# EasyEDA Pro project Nets and Buses.epro

# Schematic Schematic1
Board Name: Board1; Create Date: 2026-07-05; Page Name: P1; Project Name: Nets; Schematic Name: Schematic1; Update Date: 2026-07-05; Company: EasyEDA.com; Page Size: A4; Version: V1.0
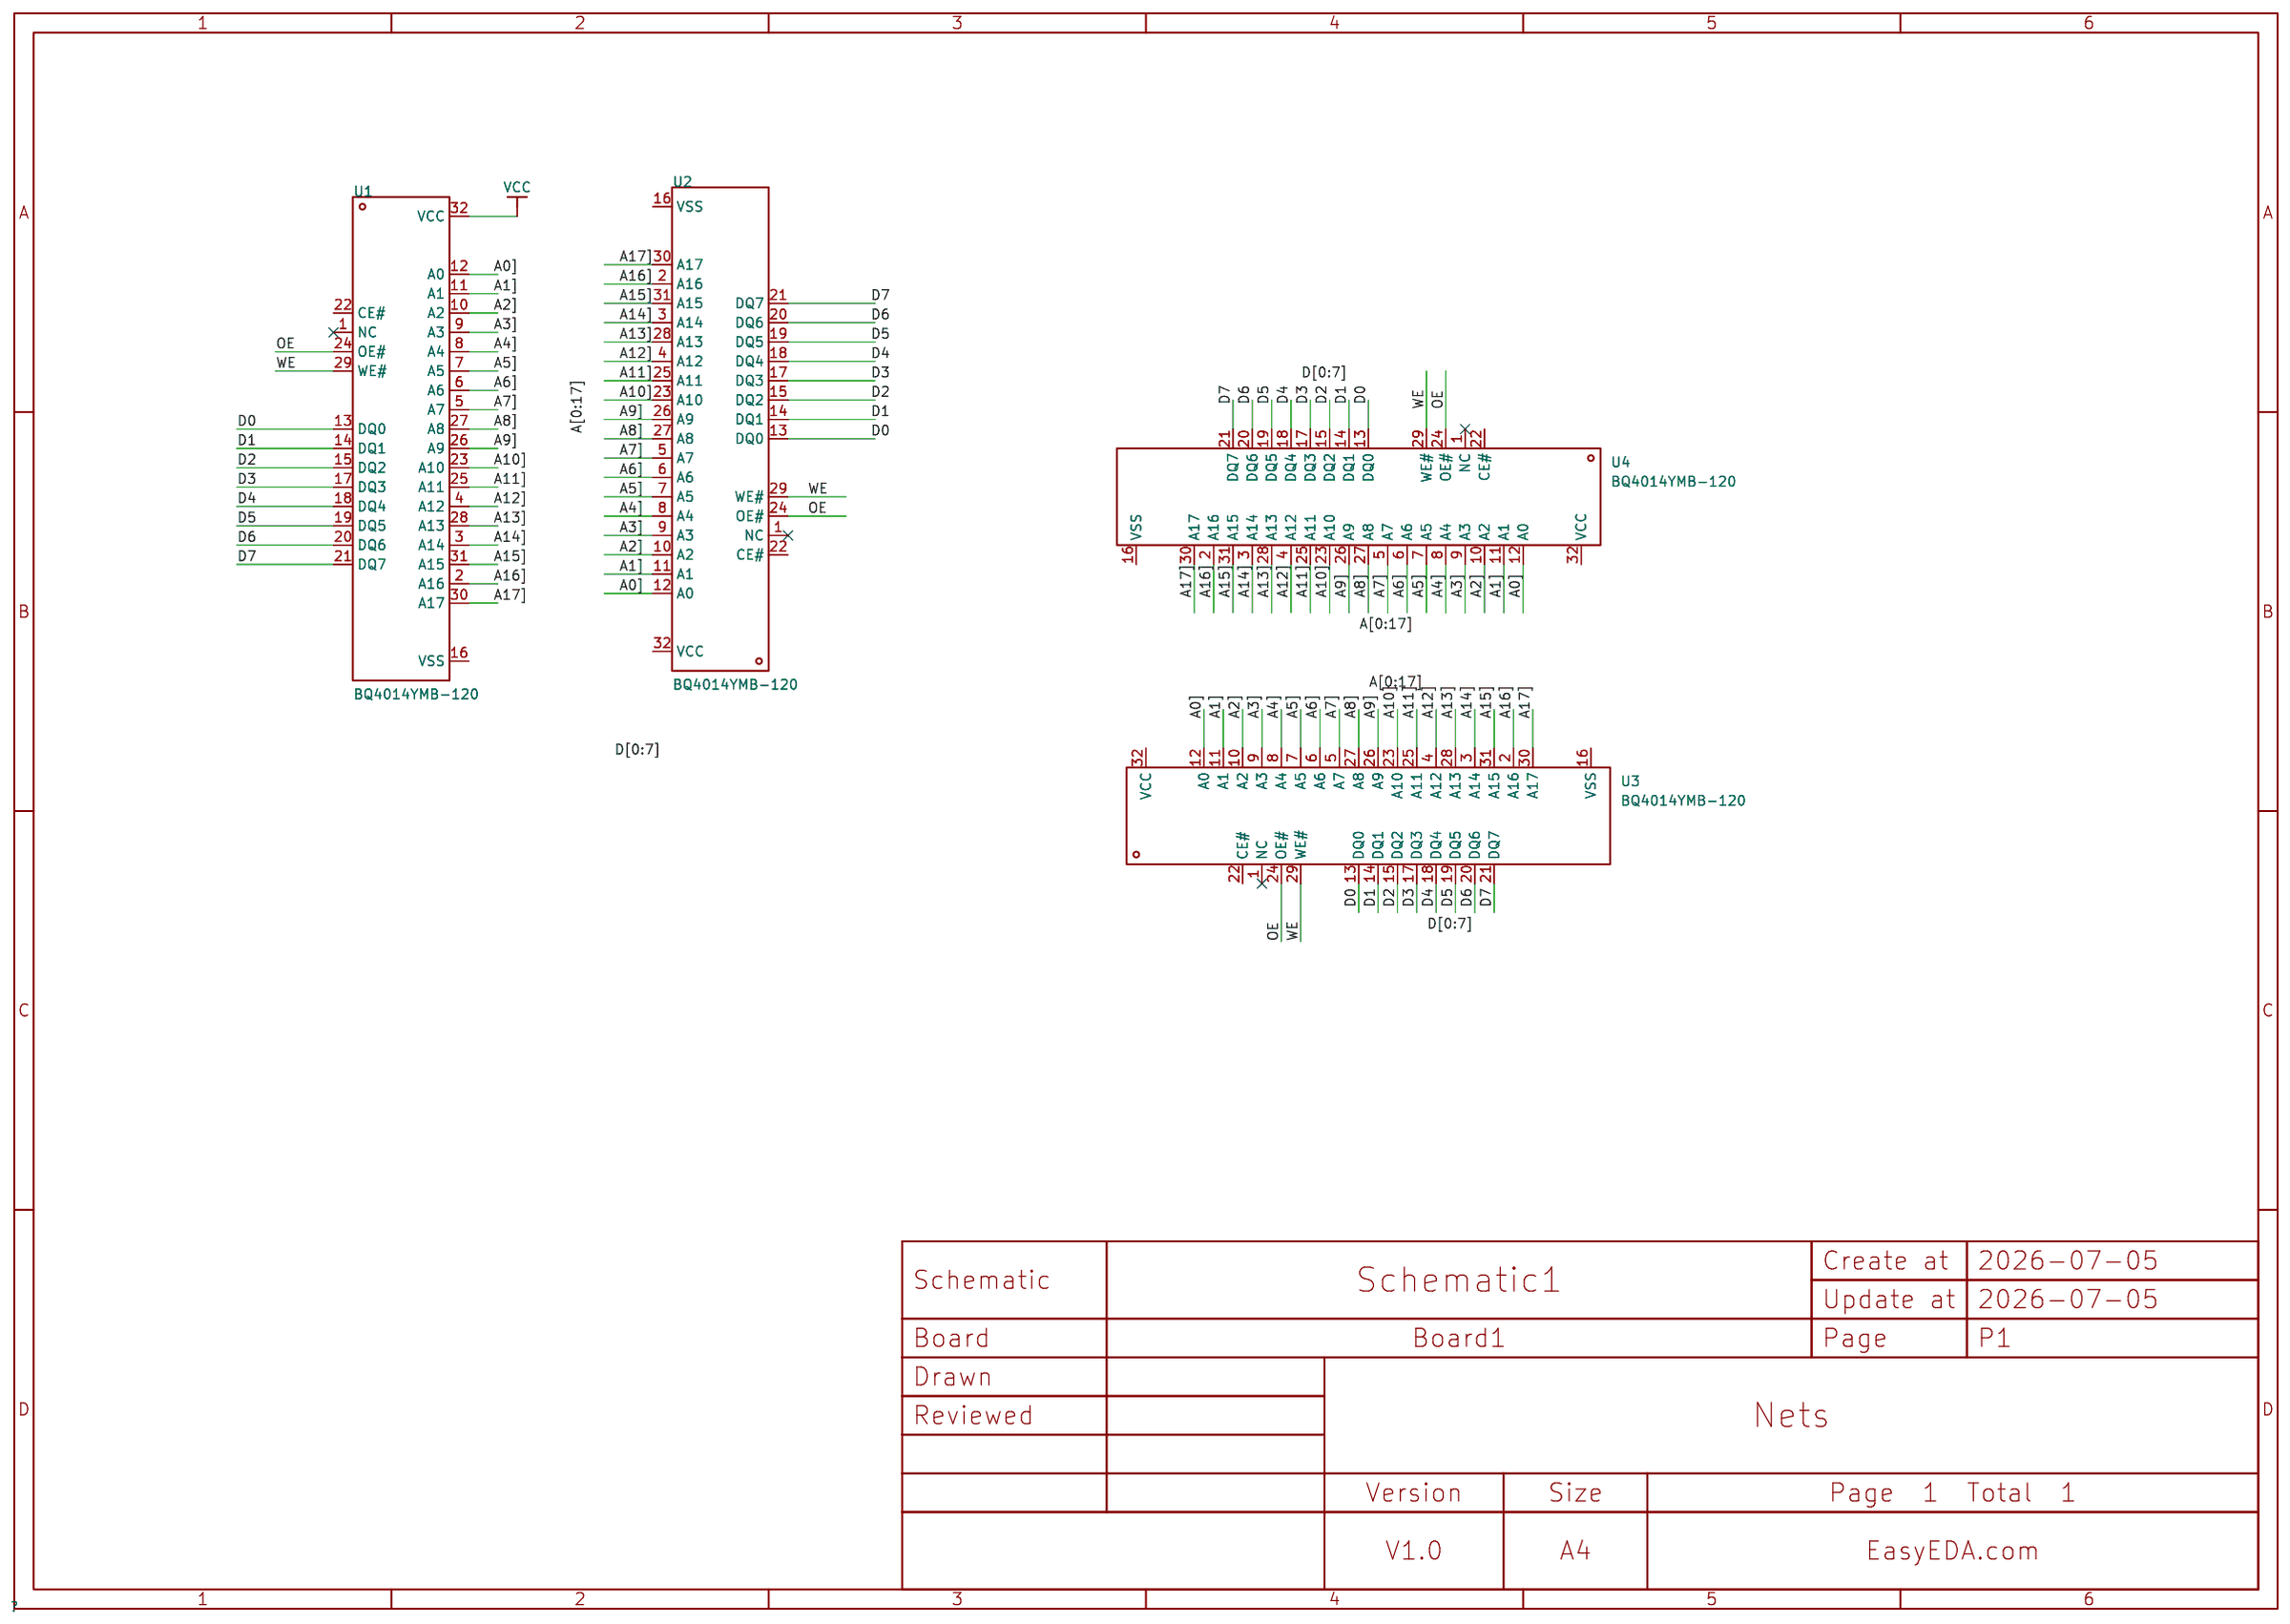
[diagram p0: schematic sheet]

## Parts
U1  BQ4014YMB-120  [EDIP-32_L53.0-W18.8-P2.54-LS16.0-BL]
U2  BQ4014YMB-120  [EDIP-32_L53.0-W18.8-P2.54-LS16.0-BL]
U3  BQ4014YMB-120  [EDIP-32_L53.0-W18.8-P2.54-LS16.0-BL]
U4  BQ4014YMB-120  [EDIP-32_L53.0-W18.8-P2.54-LS16.0-BL]

## Library data of the parts
U1-U4 = BQ4014YMB-120: Voltage - Supply:4.75V~5.5V Voltage - Supply:4.75V~5.5V Access Time:120ns; Supplier Part: C20525351; Manufacturer: TI(德州仪器); Supplier Footprint: 32-DIP Module (18.42x52.96); JLCPCB Part Class: Extended Part; Supplier: LCSC; Voltage - Supply: 4.75V~5.5V; Access Time: 120ns

## Nets
VCC: U1.32(VCC)
A0]: U1.12(A0) U2.12(A0) U3.12(A0) U4.12(A0)
A1]: U1.11(A1) U2.11(A1) U3.11(A1) U4.11(A1)
A2]: U1.10(A2) U2.10(A2) U3.10(A2) U4.10(A2)
A3]: U1.9(A3) U2.9(A3) U3.9(A3) U4.9(A3)
A4]: U1.8(A4) U2.8(A4) U3.8(A4) U4.8(A4)
A5]: U1.7(A5) U2.7(A5) U3.7(A5) U4.7(A5)
A6]: U1.6(A6) U2.6(A6) U3.6(A6) U4.6(A6)
A7]: U1.5(A7) U2.5(A7) U3.5(A7) U4.5(A7)
A8]: U1.27(A8) U2.27(A8) U3.27(A8) U4.27(A8)
A9]: U1.26(A9) U2.26(A9) U3.26(A9) U4.26(A9)
A10]: U1.23(A10) U2.23(A10) U3.23(A10) U4.23(A10)
A11]: U1.25(A11) U2.25(A11) U3.25(A11) U4.25(A11)
A12]: U1.4(A12) U2.4(A12) U3.4(A12) U4.4(A12)
A13]: U1.28(A13) U2.28(A13) U3.28(A13) U4.28(A13)
A14]: U1.3(A14) U2.3(A14) U3.3(A14) U4.3(A14)
A15]: U1.31(A15) U2.31(A15) U3.31(A15) U4.31(A15)
A16]: U1.2(A16) U2.2(A16) U3.2(A16) U4.2(A16)
A17]: U1.30(A17) U2.30(A17) U3.30(A17) U4.30(A17)
D0: U1.13(DQ0) U2.13(DQ0) U3.13(DQ0) U4.13(DQ0)
D1: U1.14(DQ1) U2.14(DQ1) U3.14(DQ1) U4.14(DQ1)
D2: U1.15(DQ2) U2.15(DQ2) U3.15(DQ2) U4.15(DQ2)
D3: U1.17(DQ3) U2.17(DQ3) U3.17(DQ3) U4.17(DQ3)
D4: U1.18(DQ4) U2.18(DQ4) U3.18(DQ4) U4.18(DQ4)
D5: U1.19(DQ5) U2.19(DQ5) U3.19(DQ5) U4.19(DQ5)
D6: U1.20(DQ6) U2.20(DQ6) U3.20(DQ6) U4.20(DQ6)
D7: U1.21(DQ7) U2.21(DQ7) U3.21(DQ7) U4.21(DQ7)
OE: U1.24(OE#) U2.24(OE#) U3.24(OE#) U4.24(OE#)
WE: U1.29(WE#) U2.29(WE#) U3.29(WE#) U4.29(WE#)

Not connected (* = marked no-connect by the designer): U1 1(NC)* 16(VSS) 22(CE#); U2 1(NC)* 16(VSS) 22(CE#) 32(VCC); U3 1(NC)* 16(VSS) 22(CE#) 32(VCC); U4 1(NC)* 16(VSS) 22(CE#) 32(VCC)
